# Altium schematic sheet remote.SchDoc
size A4
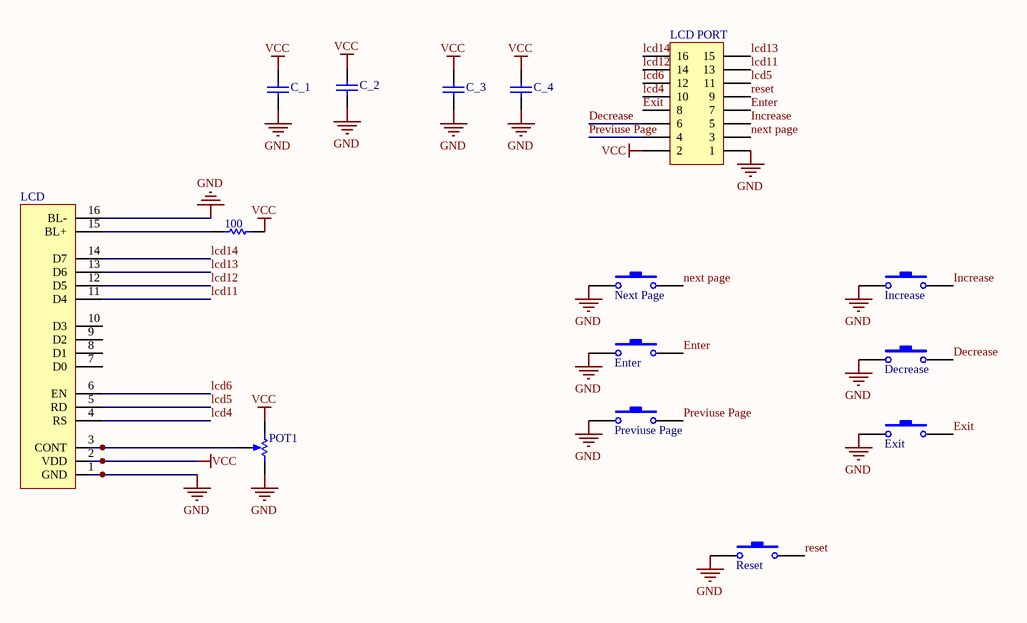
[diagram p0: remote.SchDoc]

## Parts
C_1  100nF  [CAP 1206]  (value not drawn)
C_2  100nF  [CAP 1206]  (value not drawn)
C_3  100nF  [CAP 2]  (value not drawn)
C_4  100nF  [CAP 2]  (value not drawn)
LCD  LCD 1  [LCD 4X20 BLUE]  (value not drawn)
LCD_PORT  LCD PORT  [CON IDC 2X8]  (value not drawn)
PB1  Next Page  [push button 4]
PB2  Enter  [push button 4]
PB3  Previuse Page  [push button 4]
PB4  Increase  [PUSH BUTTON 4]
PB5  Decrease  [push button 4]
PB6  Reset  [push button 4]
PB7  Exit  [push button 4]
POT1  10K  [Multi Turn 01]  (value not drawn)
R3  100  [res 1206]

## Nets
GND: C_1.1 C_2.1 C_3.1 C_4.1 LCD.1(GND) LCD.16(BL-) LCD_PORT.1 PB1.1 PB2.1 PB3.1 PB4.1 PB5.1 PB6.1 PB7.1 POT1.3(BOT)
VCC: C_1.2 C_2.2 C_3.2 C_4.2 LCD.2(VDD) LCD_PORT.2 POT1.1(TOP) R3.1
Decrease: LCD_PORT.6 PB5.2
Enter: LCD_PORT.7 PB2.2
Exit: LCD_PORT.8 PB7.2
Increase: LCD_PORT.5 PB4.2
lcd4: LCD.4(RS) LCD_PORT.10
lcd5: LCD.5(RD) LCD_PORT.11
lcd6: LCD.6(EN) LCD_PORT.12
lcd11: LCD.11(D4) LCD_PORT.13
lcd12: LCD.12(D5) LCD_PORT.14
lcd13: LCD.13(D6) LCD_PORT.15
lcd14: LCD.14(D7) LCD_PORT.16
next page: LCD_PORT.3 PB1.2
Previuse Page: LCD_PORT.4 PB3.2
reset: LCD_PORT.9 PB6.2
NetLCD_3: LCD.3(CONT) POT1.2(TAP)
NetLCD_15: LCD.15(BL+) R3.2

Not connected (* = marked no-connect by the designer): LCD 7(D0) 8(D1) 9(D2) 10(D3)

## Library data of the parts
C_1-C_4 = Cap: Capacitor; Published: 8-Jun-2000; LatestRevisionDate: 17-Jul-2002; LatestRevisionNote: Re-released for DXP Platform.; PackageReference: RAD-0.3; Publisher: Altium Limited
LCD = LCD 1: Header, 16-Pin, Dual row; LatestRevisionDate: 17-Jul-2002; LatestRevisionNote: Re-released for DXP Platform.; Publisher: Altium Limited
LCD_PORT = Header 8X2: Header, 8-Pin, Dual row; LatestRevisionDate: 17-Jul-2002; LatestRevisionNote: Re-released for DXP Platform.; Publisher: Altium Limited
PB1-PB7 = PUSH BUTTON: Switch; Published: 24-Mar-1999; LatestRevisionDate: 17-Jul-2002; LatestRevisionNote: Re-released for DXP Platform.; PackageReference: SPST-2; Publisher: Altium Limited
POT1 = RPot: Potentiometer; Sim Note: Enter the Resistance value and the set point into parameter fields.; Set Position: 0.5; Published: 8-Jun-2000; LatestRevisionDate: 17-Jul-2002; LatestRevisionNote: Re-released for DXP Platform.; PackageReference: VR5; Publisher: Altium Limited; Value: 10K
R3 = Res1: Resistor; Published: 8-Jun-2000; LatestRevisionDate: 17-Jul-2002; LatestRevisionNote: Re-released for DXP Platform.; PackageReference: AXIAL-0.3; Publisher: Altium Limited; PackageDescription: Axial Device, Thru-Hole; 2 Leads; 0.3 in Pin Spacing; Value: 100